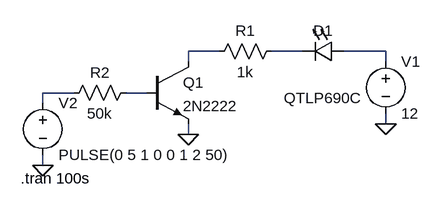
[diagram p0: schematic Transistor 2N2222 Blinking LED.asc]
Transistor 2N2222 Blinking LED.asc, the LTspice schematic file:
Version 4
SHEET 1 880 680
WIRE 288 80 240 80
WIRE 416 80 368 80
WIRE 544 80 480 80
WIRE 240 96 240 80
WIRE 544 96 544 80
WIRE 64 144 16 144
WIRE 176 144 144 144
WIRE 16 160 16 144
WIRE 544 192 544 176
WIRE 240 208 240 192
WIRE 16 256 16 240
FLAG 544 192 0
FLAG 240 208 0
FLAG 16 256 0
SYMBOL npn 176 96 R0
SYMATTR InstName Q1
SYMATTR Value 2N2222
SYMBOL voltage 544 80 R0
WINDOW 123 0 0 Left 0
WINDOW 39 0 0 Left 0
SYMATTR InstName V1
SYMATTR Value 12
SYMBOL res 384 64 R90
WINDOW 0 0 56 VBottom 2
WINDOW 3 32 56 VTop 2
SYMATTR InstName R1
SYMATTR Value 1k
SYMBOL LED 480 64 R90
WINDOW 0 0 32 VBottom 2
WINDOW 3 72 32 VTop 2
SYMATTR InstName D1
SYMATTR Value QTLP690C
SYMBOL voltage 16 144 R0
WINDOW 123 0 0 Left 0
WINDOW 39 0 0 Left 0
SYMATTR InstName V2
SYMATTR Value PULSE(0 5 1 0 0 1 2 50)
SYMBOL res 160 128 R90
WINDOW 0 0 56 VBottom 2
WINDOW 3 32 56 VTop 2
SYMATTR InstName R2
SYMATTR Value 50k
TEXT -18 276 Left 2 !.tran 100s

The netlist it stands for:
* Transistor 2N2222 Blinking LED.asc
Q1 N001 N005 0 0 2N2222
V1 N003 0 12
R1 N002 N001 1k
D1 N003 N002 QTLP690C
V2 N004 0 PULSE(0 5 1 0 0 1 2 50)
R2 N005 N004 50k
.model D D
.lib standard.dio
.model NPN NPN
.model PNP PNP
.lib standard.bjt
.tran 100s
.backanno
.end